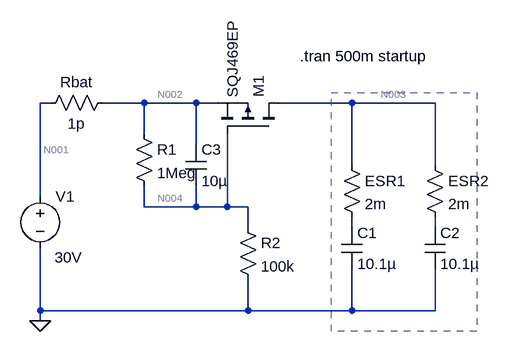
[diagram p0: schematic pmos_inrush_current_limiter.asc]
pmos_inrush_current_limiter.asc, the LTspice schematic file:
Version 4
SHEET 1 880 680
WIRE 16 64 0 64
WIRE 160 64 96 64
WIRE 240 64 160 64
WIRE 272 64 240 64
WIRE 480 64 368 64
WIRE 608 64 480 64
WIRE 160 112 160 64
WIRE 240 128 240 64
WIRE 480 160 480 64
WIRE 608 160 608 64
WIRE 0 208 0 64
WIRE 160 224 160 192
WIRE 240 224 240 192
WIRE 240 224 160 224
WIRE 288 224 288 112
WIRE 288 224 240 224
WIRE 320 224 288 224
WIRE 320 256 320 224
WIRE 480 256 480 240
WIRE 608 256 608 240
WIRE 0 384 0 288
WIRE 320 384 320 336
WIRE 320 384 0 384
WIRE 480 384 480 320
WIRE 480 384 320 384
WIRE 608 384 608 320
WIRE 608 384 480 384
WIRE 0 400 0 384
FLAG 0 400 0
SYMBOL voltage 0 192 R0
WINDOW 123 0 0 Left 0
WINDOW 39 0 0 Left 0
WINDOW 3 22 110 Left 2
SYMATTR Value 30V
SYMATTR InstName V1
SYMBOL cap 464 256 R0
SYMATTR InstName C1
SYMATTR Value 10.1µ
SYMBOL res 464 144 R0
SYMATTR InstName ESR1
SYMATTR Value 2m
SYMBOL res 0 80 R270
WINDOW 0 32 56 VTop 2
WINDOW 3 0 56 VBottom 2
SYMATTR InstName Rbat
SYMATTR Value 1p
SYMBOL res 592 144 R0
SYMATTR InstName ESR2
SYMATTR Value 2m
SYMBOL cap 592 256 R0
SYMATTR InstName C2
SYMATTR Value 10.1µ
SYMBOL cap 224 128 R0
SYMATTR InstName C3
SYMATTR Value 10µ
SYMBOL res 304 240 R0
SYMATTR InstName R2
SYMATTR Value 100k
SYMBOL res 144 96 R0
SYMATTR InstName R1
SYMATTR Value 1Meg
SYMBOL pmos 368 112 M270
SYMATTR InstName M1
SYMATTR Value SQJ469EP
TEXT 400 -8 Left 2 !.tran 500m startup
RECTANGLE Normal 672 416 448 48 2

The netlist it stands for:
* pmos_inrush_current_limiter.asc
V1 N001 0 30V
C1 N005 0 10.1µ
R§ESR1 N003 N005 2m
Rbat N001 N002 1p
R§ESR2 N003 N006 2m
C2 N006 0 10.1µ
C3 N002 N004 10µ
R2 N004 0 100k
R1 N002 N004 1Meg
M1 N003 N004 N002 N002 SQJ469EP
.model NMOS NMOS
.model PMOS PMOS
.lib standard.mos
.tran 500m startup
.backanno
.end

* Results of the author's LTspice run, read from the files saved beside the schematic
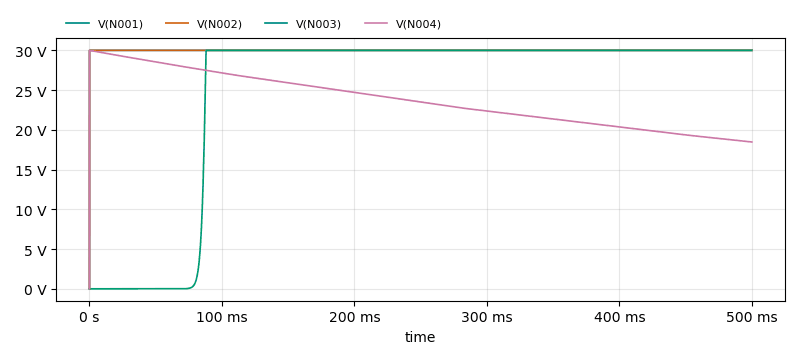
[diagram p1: Transient Analysis of pmos_inrush_current_limiter.asc, plotted from the saved traces]
* Transient Analysis, 1 run:
*   V(N001): min 0 V, max 30 V, average 30 V, rms 30 V, last 30 V
*   V(N002): min 0 V, max 30 V, average 30 V, rms 30 V, last 30 V
*   V(N003): min 0 V, max 30 V, average 24.87 V, rms 27.28 V, last 30 V
*   V(N004): min 0 V, max 30 V, average 23.75 V, rms 24.01 V, last 18.47 V